# EAGLE design arduino-shield (EAGLE 9.2.2)

## Sheet 1 of 2
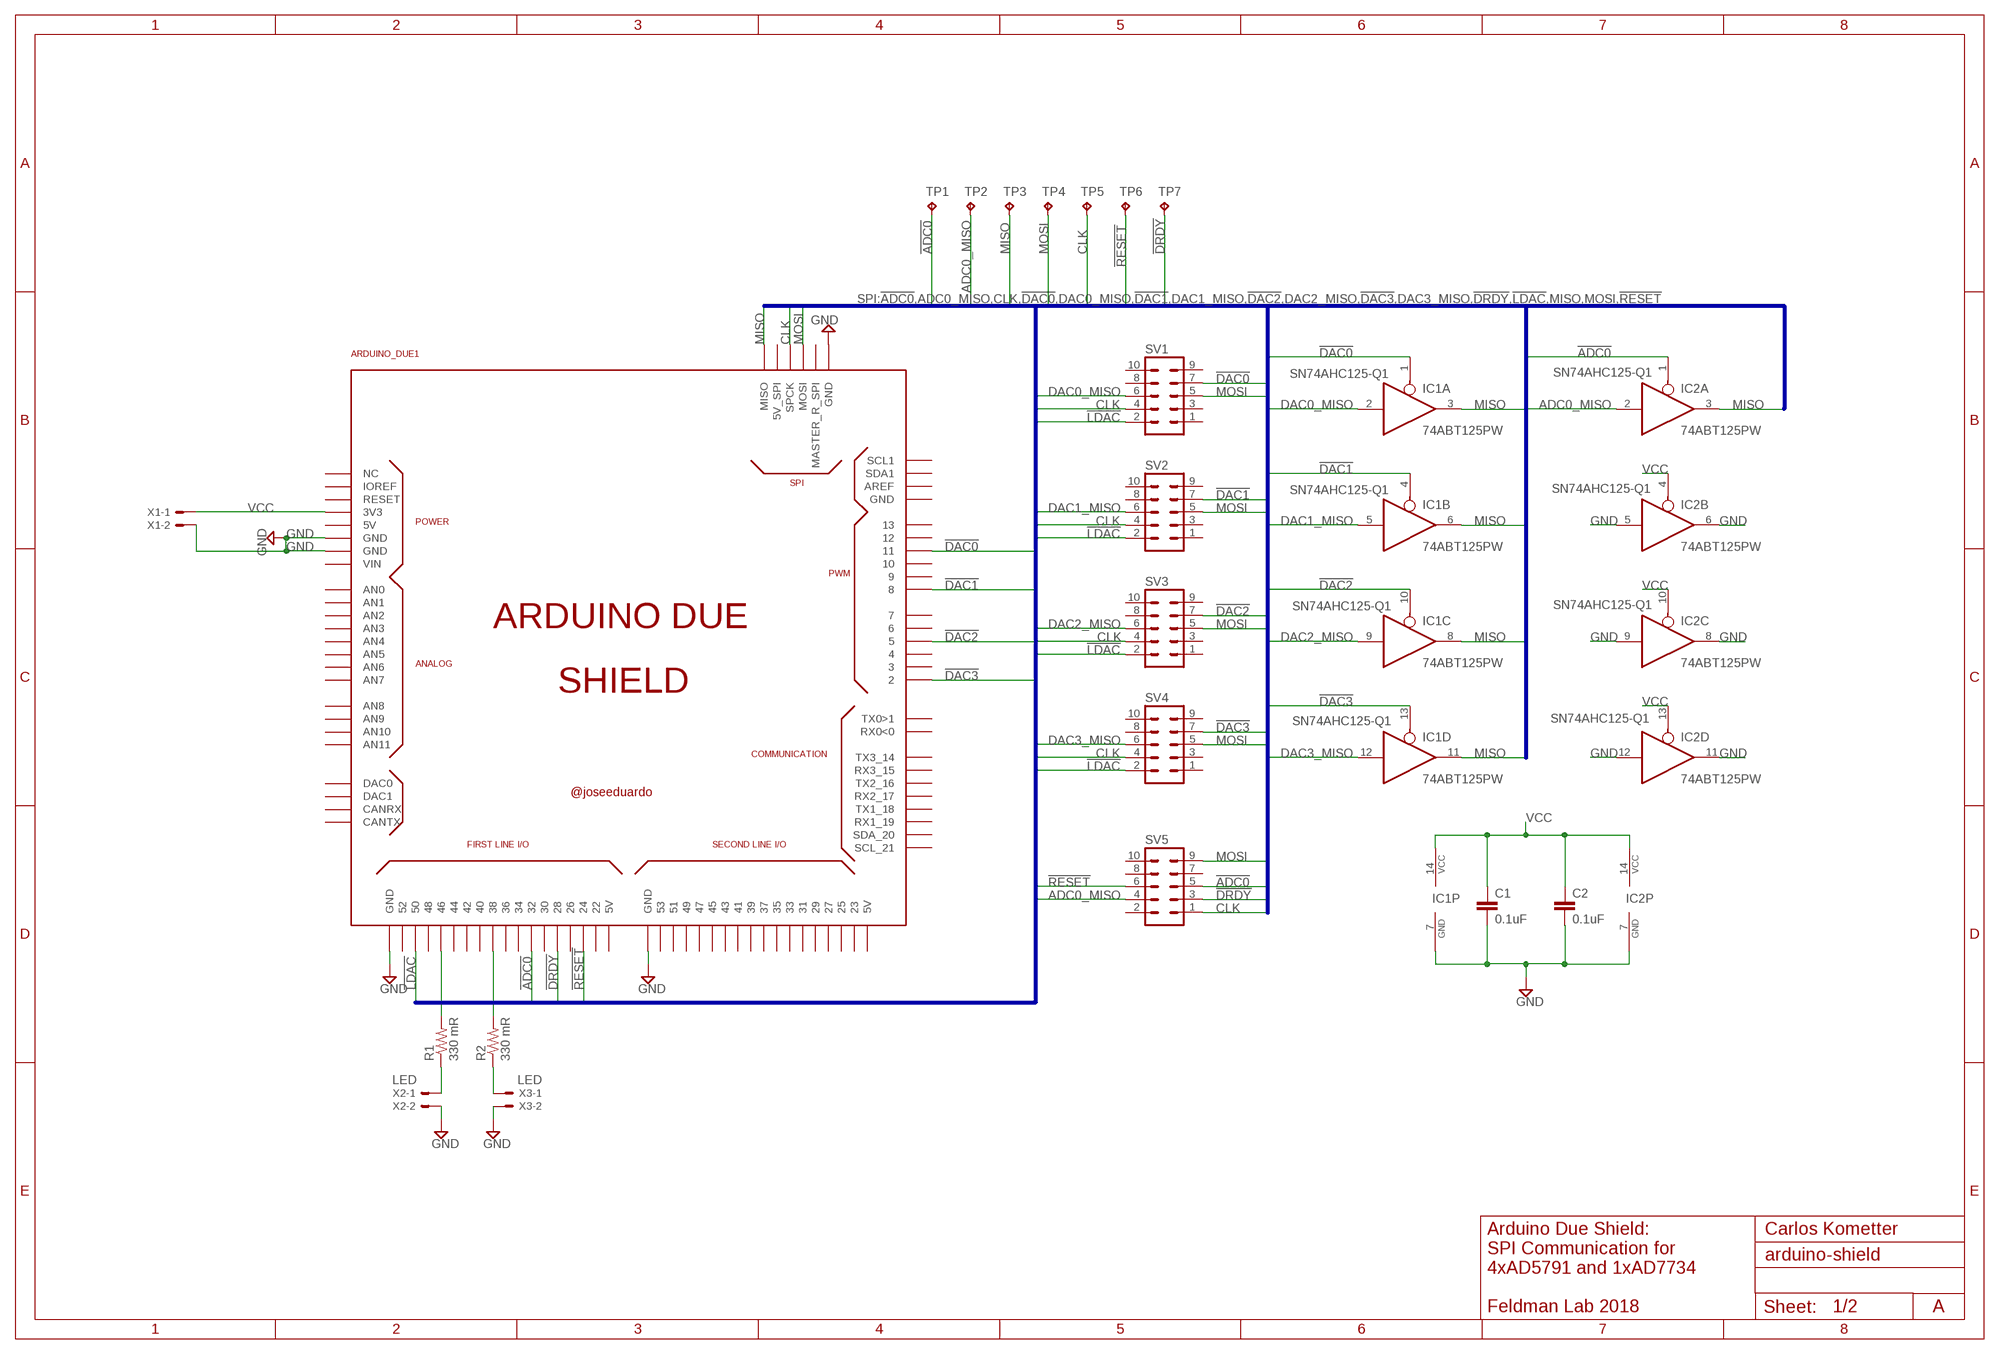
[diagram p0: schematic, sheet 1]

### Parts
ARDUINO_DUE1  ARDUINO_DUE_SHIELD  [ARDUINO_DUE_SHIELD]
C1  0.1uF  C-EUC0603  [C0603]
C2  0.1uF  C-EUC0603  [C0603]
IC1  74ABT125PW  [TSSOP14]
IC2  74ABT125PW  [TSSOP14]
R1  330 mR  R-US_R1206  [R1206]
R2  330 mR  R-US_R1206  [R1206]
SV1  MA05-2  [MA05-2]
SV2  MA05-2  [MA05-2]
SV3  MA05-2  [MA05-2]
SV4  MA05-2  [MA05-2]
SV5  MA05-2  [MA05-2]
TP1  TPPAD1-13  [P1-13]
TP2  TPPAD1-13  [P1-13]
TP3  TPPAD1-13  [P1-13]
TP4  TPPAD1-13  [P1-13]
TP5  TPPAD1-13  [P1-13]
TP6  TPPAD1-13  [P1-13]
TP7  TPPAD1-13  [P1-13]
X1  22-23-2021  [22-23-2021]
X2  22-23-2021  [22-23-2021]
X3  22-23-2021  [22-23-2021]

### Nets
!ADC0!: ARDUINO_DUE1.32 IC2.1(A:OE) SV5.5 TP1.TP
!DAC0!: ARDUINO_DUE1.11 IC1.1(A:OE) SV1.7
!DAC1!: ARDUINO_DUE1.8 IC1.4(B:OE) SV2.7
!DAC2!: ARDUINO_DUE1.5 IC1.10(C:OE) SV3.7
!DAC3!: ARDUINO_DUE1.2 IC1.13(D:OE) SV4.7
!DRDY!: ARDUINO_DUE1.28 SV5.3 TP7.TP
!LDAC!: ARDUINO_DUE1.50 SV1.2 SV2.2 SV3.2 SV4.2
!RESET!: ARDUINO_DUE1.24 SV5.6 TP6.TP
ADC0_MISO: IC2.2(A:I) SV5.4 TP2.TP
CLK: ARDUINO_DUE1.SPCK SV1.4 SV2.4 SV3.4 SV4.4 SV5.1 TP5.TP
DAC0_MISO: IC1.2(A:I) SV1.6
DAC1_MISO: IC1.5(B:I) SV2.6
DAC2_MISO: IC1.9(C:I) SV3.6
DAC3_MISO: IC1.12(D:I) SV4.6
GND: ARDUINO_DUE1.GND ARDUINO_DUE1.GND_1(GND) ARDUINO_DUE1.GND_2(GND) ARDUINO_DUE1.GND_3(GND) ARDUINO_DUE1.GND_5(GND) C1.2 C2.2 IC1.7(P:GND) IC2.5(B:I) IC2.6(B:O) IC2.7(P:GND) IC2.8(C:O) IC2.9(C:I) IC2.11(D:O) IC2.12(D:I) X1.2 X2.2 X3.2
MISO: ARDUINO_DUE1.MISO IC1.3(A:O) IC1.6(B:O) IC1.8(C:O) IC1.11(D:O) IC2.3(A:O) TP3.TP
MOSI: ARDUINO_DUE1.MOSI SV1.5 SV2.5 SV3.5 SV4.5 SV5.9 TP4.TP
N$3: ARDUINO_DUE1.46 R1.2
N$4: R1.1 X2.1
N$6: ARDUINO_DUE1.38 R2.2
N$7: R2.1 X3.1
VCC: ARDUINO_DUE1.3V3 C1.1 C2.1 IC1.14(P:VCC) IC2.4(B:OE) IC2.10(C:OE) IC2.13(D:OE) IC2.14(P:VCC) X1.1
Unconnected: ARDUINO_DUE1.0(RX0<0) ARDUINO_DUE1.1(TX0>1) ARDUINO_DUE1.3 ARDUINO_DUE1.4 ARDUINO_DUE1.5V0(5V) ARDUINO_DUE1.5V0_1(5V) ARDUINO_DUE1.5V0_2(5V) ARDUINO_DUE1.5V_2(5V_SPI) ARDUINO_DUE1.6 ARDUINO_DUE1.7 ARDUINO_DUE1.9 ARDUINO_DUE1.10 ARDUINO_DUE1.12 ARDUINO_DUE1.13 ARDUINO_DUE1.14(TX3_14) ARDUINO_DUE1.15(RX3_15) ARDUINO_DUE1.16(TX2_16) ARDUINO_DUE1.17(RX2_17) ARDUINO_DUE1.18(TX1_18) ARDUINO_DUE1.19(RX1_19) ARDUINO_DUE1.20(SDA_20) ARDUINO_DUE1.21(SCL_21) ARDUINO_DUE1.22 ARDUINO_DUE1.23 ARDUINO_DUE1.25 ARDUINO_DUE1.26 ARDUINO_DUE1.27 ARDUINO_DUE1.29 ARDUINO_DUE1.30 ARDUINO_DUE1.31 ARDUINO_DUE1.33 ARDUINO_DUE1.34 ARDUINO_DUE1.35 ARDUINO_DUE1.36 ARDUINO_DUE1.37 ARDUINO_DUE1.39 ARDUINO_DUE1.40 ARDUINO_DUE1.41 ARDUINO_DUE1.42 ARDUINO_DUE1.43 ARDUINO_DUE1.44 ARDUINO_DUE1.45 ARDUINO_DUE1.47 ARDUINO_DUE1.48 ARDUINO_DUE1.49 ARDUINO_DUE1.51 ARDUINO_DUE1.52 ARDUINO_DUE1.53 ARDUINO_DUE1.A0(AN0) ARDUINO_DUE1.A1(AN1) ARDUINO_DUE1.A2(AN2) ARDUINO_DUE1.A3(AN3) ARDUINO_DUE1.A4(AN4) ARDUINO_DUE1.A5(AN5) ARDUINO_DUE1.A6(AN6) ARDUINO_DUE1.A7(AN7) ARDUINO_DUE1.A8(AN8) ARDUINO_DUE1.A9(AN9) ARDUINO_DUE1.A10(AN10) ARDUINO_DUE1.A11(AN11) ARDUINO_DUE1.AREF ARDUINO_DUE1.CANRX ARDUINO_DUE1.CANTX ARDUINO_DUE1.DAC0 ARDUINO_DUE1.DAC1 ARDUINO_DUE1.GND_4(GND) ARDUINO_DUE1.IOREF ARDUINO_DUE1.MASTER_RESET_SPI(MASTER_R_SPI) ARDUINO_DUE1.NC_2(NC) ARDUINO_DUE1.RESET ARDUINO_DUE1.SCL1 ARDUINO_DUE1.SDA1 ARDUINO_DUE1.VIN SV1.1 SV1.3 SV1.8 SV1.9 SV1.10 SV2.1 SV2.3 SV2.8 SV2.9 SV2.10 SV3.1 SV3.3 SV3.8 SV3.9 SV3.10 SV4.1 SV4.3 SV4.8 SV4.9 SV4.10 SV5.2 SV5.7 SV5.8 SV5.10

### Buses
SPI:!ADC0!,ADC0_MISO,CLK,!DAC0!,DAC0_MISO,!DAC1!,DAC1_MISO,!DAC2!,DAC2_MISO,!DAC3!,DAC3_MISO,!DRDY!,!LDAC!,MISO,MOSI,!RESET!

### Notes on the sheet
- SN74AHC125-Q1 | SN74AHC125-Q1
- SN74AHC125-Q1 | SN74AHC125-Q1
- SN74AHC125-Q1 | SN74AHC125-Q1
- SN74AHC125-Q1 | SN74AHC125-Q1
- LED | LED
- Carlos Kometter
- Arduino Due Shield:
  SPI Communication for
  4xAD5791 and 1xAD7734
  
  Feldman Lab 2018
- A

## Sheet 2 of 2
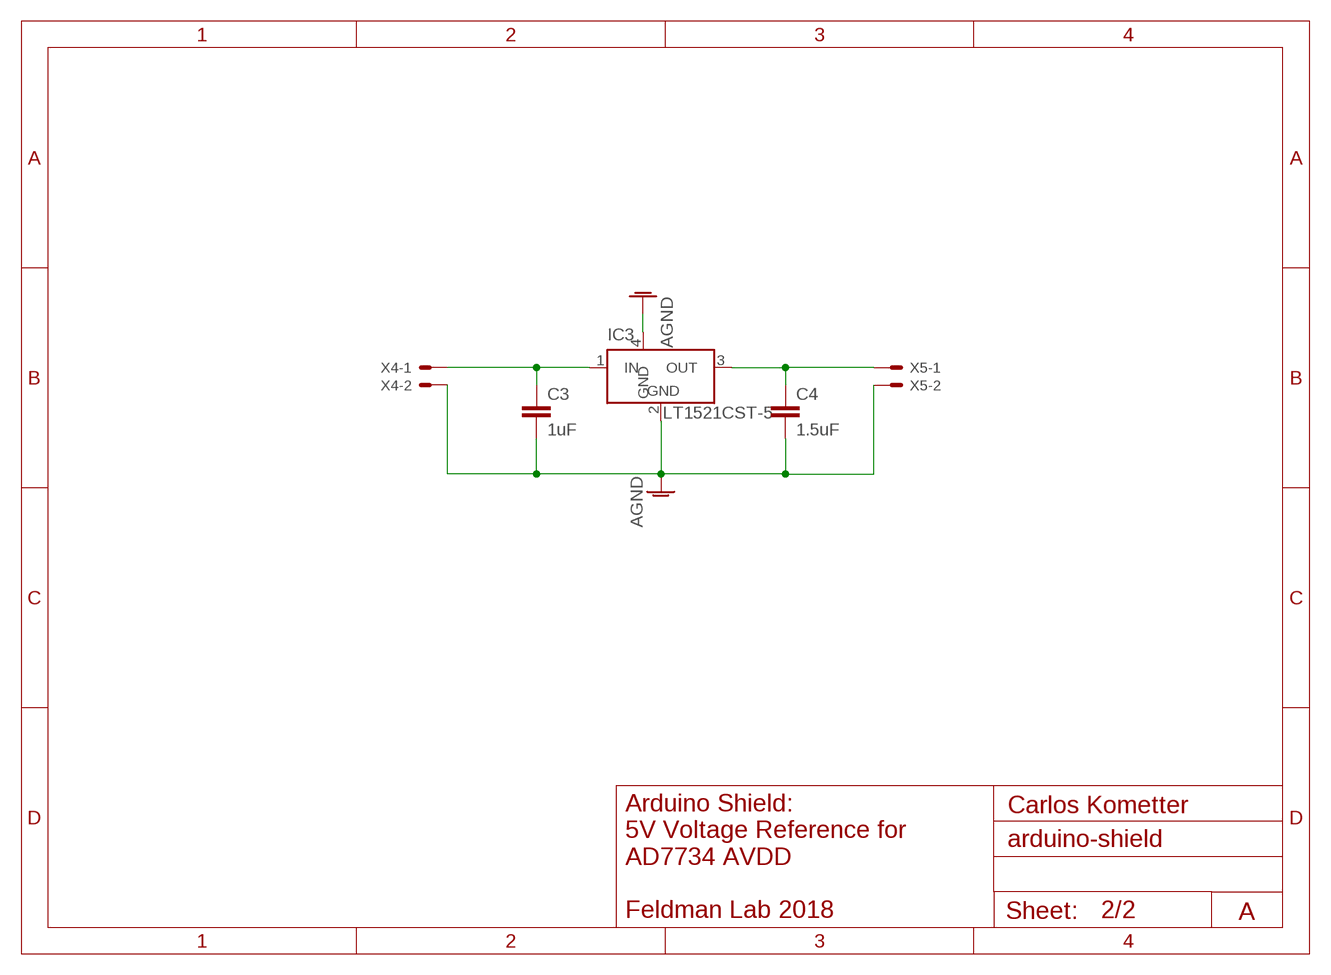
[diagram p1: schematic, sheet 2]

### Parts
C3  1uF  C-EUC0603  [C0603]
C4  1.5uF  C-EUC0603  [C0603]
IC3  LT1129CST5  [SOT223]
X4  22-23-2021  [22-23-2021]
X5  22-23-2021  [22-23-2021]

### Nets
AGND: C3.2 C4.2 IC3.2(GND) IC3.4(GND) X4.2 X5.2
N$1: C3.1 IC3.1(IN) X4.1
N$2: C4.1 IC3.3(OUT) X5.1

### Notes on the sheet
- LT1521CST-5
- Carlos Kometter
- Arduino Shield:
  5V Voltage Reference for
  AD7734 AVDD
  
  Feldman Lab 2018
- A

## Library data of the parts
ARDUINO_DUE1 = arduino_due_shield:ARDUINO_DUE_SHIELD
C1-C4 = resistor:C-EU: CAPACITOR, European symbol
IC1 IC2 = 74xx-us:74*125: Quad bus BUFFER, 3-state
IC3 = linear-technology:LT1129CST5: VOLTAGE REGULATOR with shutdown; MPN: LT1129CST-5#PBF; OC_FARNELL: 1663375; OC_NEWARK: 57M2069
R1 R2 = rcl:R-US_: RESISTOR, American symbol; SPICEPREFIX: R
SV1-SV5 = con-lstb:MA05-2: PIN HEADER; OC_FARNELL: unknown; OC_NEWARK: unknown
TP1-TP7 = testpad:TP: Test pad
X1-X5 = con-molex:22-23-2021: .100" (2.54mm) Center Header - 2 Pin; MF: MOLEX; MPN: 22-23-2021; OC_FARNELL: 1462926; OC_NEWARK: 25C3832

## Board
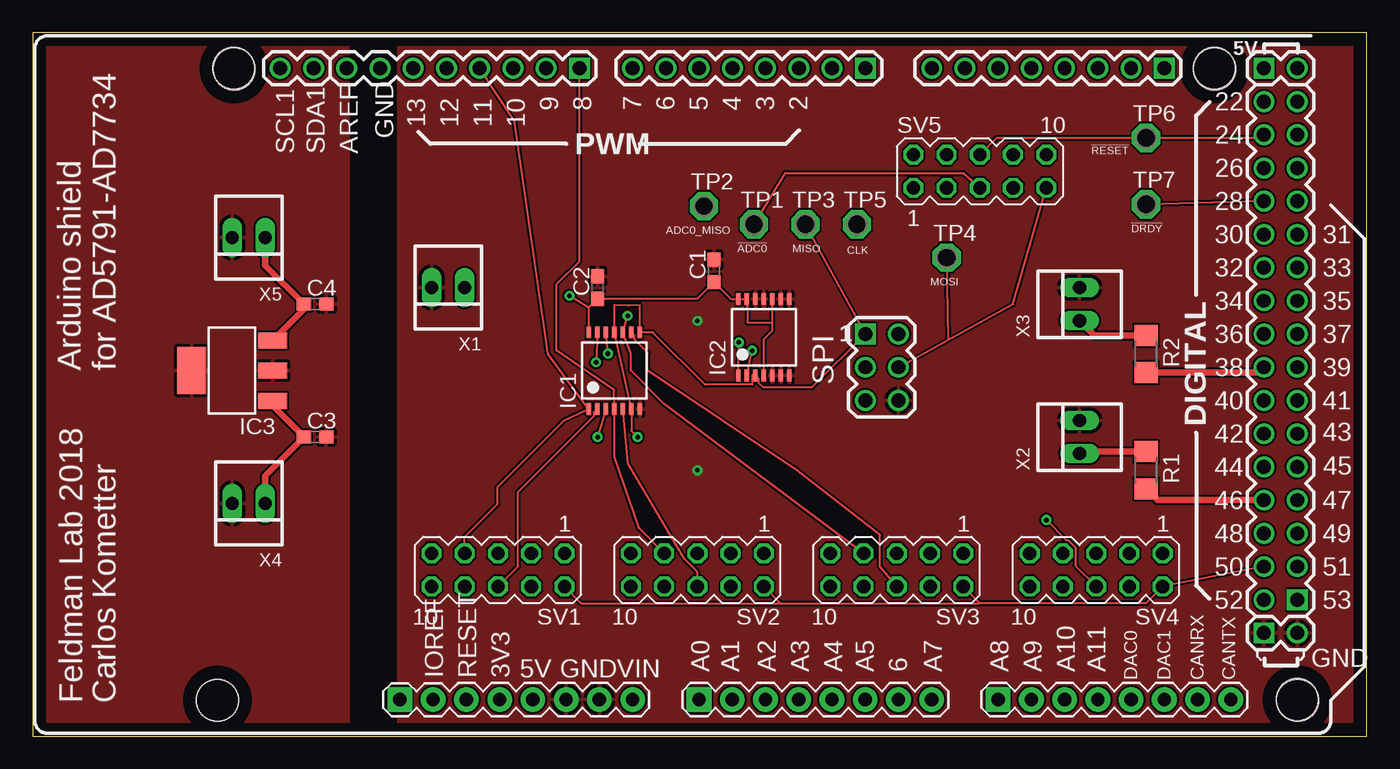
[diagram p2: board, top side]
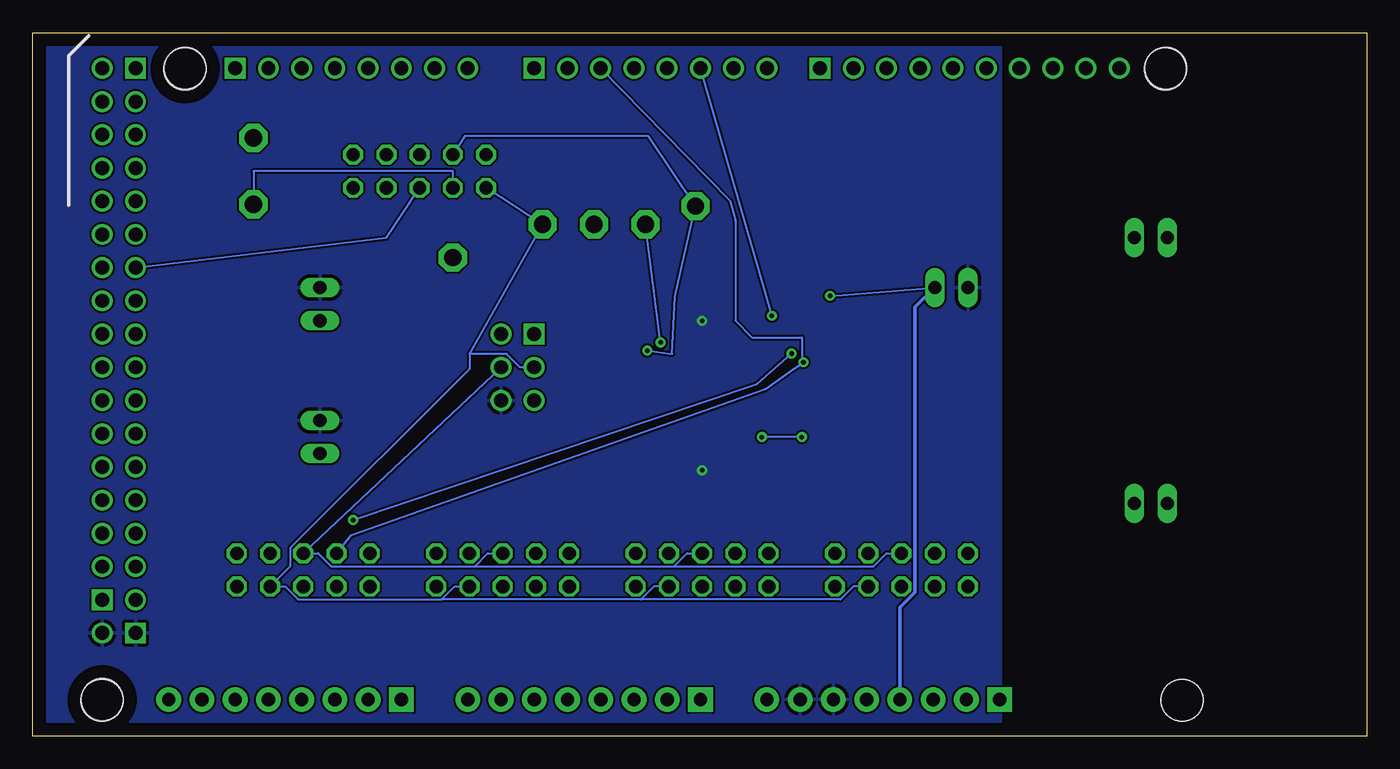
[diagram p3: board, bottom side, seen from below]

Size 101.96 x 53.77 mm. Coordinates in mm from the lower left corner, seen from the top.
Outline: 0,0 101.96,0 101.96,53.77 0,53.77 0,0
Copper layers (1*16): Top 0.035mm / dielectric 1.5mm / Bottom 0.035mm
Design rules "default": minimum track width 6mil, minimum drill 0.35mm, track to track 6mil, track to pad 6mil, pad to pad 6mil, via to via 6mil, smd to smd 6mil, copper to edge 40mil, drill to drill 6mil, minimum pad ring 10mil, minimum via ring 8mil, stop-mask expansion 4mil, vias tented up to drill 0mil, thermal gap 10mil

### Footprints (pad centres in the part's own frame; a part is rotated, then mirrored left to right if it is on the bottom)
ARDUINO_DUE_SHIELD = drill 1.067 square: 0 63.373,51.816; 5V0_1 93.853,51.816; 8 41.529,51.816; 21 86.233,51.816; 53 96.393,11.176; GND_2 93.853,8.636; MISO 63.373,31.496 | drill 1.067: 1 60.833,51.816; 2 58.293,51.816; 3 55.753,51.816; 4 53.213,51.816; 5 50.673,51.816; 5V0_2 96.393,51.816; 5V_2 65.913,31.496; 6 48.133,51.816; 7 45.593,51.816; 9 38.989,51.816; 10 36.449,51.816; 11 33.909,51.816; 12 31.369,51.816; 13 28.829,51.816; 14 68.453,51.816; 15 70.993,51.816; 16 73.533,51.816; 17 76.073,51.816; 18 78.613,51.816; 19 81.153,51.816; 20 83.693,51.816; 22 93.853,49.276; 23 96.393,49.276; 24 93.853,46.736; 25 96.393,46.736; 26 93.853,44.196; 27 96.393,44.196; 28 93.853,41.656; 29 96.393,41.656; 30 93.853,39.116; 31 96.393,39.116; 32 93.853,36.576; 33 96.393,36.576; 34 93.853,34.036; 35 96.393,34.036; 36 93.853,31.496; 37 96.393,31.496; 38 93.853,28.956; 39 96.393,28.956; 40 93.853,26.416; 41 96.393,26.416; 42 93.853,23.876; 43 96.393,23.876; 44 93.853,21.336; 45 96.393,21.336; 46 93.853,18.796; 47 96.393,18.796; 48 93.853,16.256; 49 96.393,16.256; 50 93.853,13.716; 51 96.393,13.716; 52 93.853,11.176; AREF 23.749,51.816; GND_3 96.393,8.636; GND_4 26.289,51.816; GND_5 65.913,26.416; MASTER_RESET_SPI 63.373,26.416; MOSI 65.913,28.956; SCL1 18.669,51.816; SDA1 21.209,51.816; SPCK 63.373,28.956 | drill 1.016 pad 1.88: 3V3 35.433,3.556; 5V0 37.973,3.556; A1 53.213,3.556; A2 55.753,3.556; A3 58.293,3.556; A4 60.833,3.556; A5 63.373,3.556; A6 65.913,3.556; A7 68.453,3.556; A9 76.073,3.556; A10 78.613,3.556; A11 81.153,3.556; CANRX 88.773,3.556; CANTX 91.313,3.556; DAC0 83.693,3.556; DAC1 86.233,3.556; GND 40.513,3.556; GND_1 43.053,3.556; IOREF 30.346,3.543; RESET 32.893,3.555; VIN 45.593,3.556 | drill 1.016 pad 1.88 square: A0 50.673,3.556; A8 73.533,3.556; NC_2 27.806,3.543 | hole 3.2: 15.113,51.816; 90.043,51.816; 96.393,3.556; 96.418,3.505; 15.138,51.765; 90.068,51.765; 13.868,3.505
C0603 = smd 1.1 x 1: 1 -0.85,0; 2 0.85,0
TSSOP14 = smd 0.35 x 0.9: 1 -1.95,-2.925; 2 -1.3,-2.925; 3 -0.65,-2.925; 4 0,-2.925; 5 0.65,-2.925; 6 1.3,-2.925; 7 1.95,-2.925; 8 1.95,2.925; 9 1.3,2.925; 10 0.65,2.925; 11 0,2.925; 12 -0.65,2.925; 13 -1.3,2.925; 14 -1.95,2.925
SOT223 = smd 1.219 x 2.235: 1 -2.311,-3.099; 2 0,-3.099; 3 2.311,-3.099 | smd 3.6 x 2.2: 4 0,3.099
R1206 = smd 1.6 x 1.803: 1 -1.422,0; 2 1.422,0
MA05-2 = drill 1.016 octagon: 1 -5.08,-1.27; 2 -5.08,1.27; 3 -2.54,-1.27; 4 -2.54,1.27; 5 0,-1.27; 6 0,1.27; 7 2.54,-1.27; 8 2.54,1.27; 9 5.08,-1.27; 10 5.08,1.27
P1-13 = drill 1.321 pad 2.159 octagon: TP 0,0
22-23-2021 = drill 1 long: 1 -1.27,0; 2 1.27,0

### Placement (x,y rotation side)
ARDUINO_DUE1  0.25,-0.76 0 top
C1  52.07,35.56 90 top
C2  43.18,34.29 90 top
C3  21.59,22.86 0 top
C4  21.59,33.02 0 top
IC1  44.45,27.94 0 top
IC2  55.88,30.48 0 top
IC3  15.24,27.94 90 top
R1  85.09,20.32 270 top
R2  85.09,29.21 270 top
SV1  35.56,12.7 180 top
SV2  50.8,12.7 180 top
SV3  66.04,12.7 180 top
SV4  81.28,12.7 180 top
SV5  72.39,43.18 0 top
TP1  55.12,39.12 0 top
TP2  51.31,40.51 0 top
TP3  59.05,39.12 0 top
TP4  69.85,36.58 0 top
TP5  62.99,39.12 0 top
TP6  85.09,45.72 0 top
TP7  85.09,40.64 0 top
X1  31.75,34.29 180 top
X2  80.01,22.86 90 top
X3  80.01,33.02 90 top
X4  16.51,17.78 180 top
X5  16.51,38.1 180 top

### Tracks (layer width: path | path; a pad name or v marks a point on that pad's centre or on a via)
!ADC0!  (via drill 0.35)
  Top 0.152: IC2.1 v53.98,30.1 | TP1.TP 57.53,43.05 71.12,43.05 SV5.5
  Bottom 0.152: v53.98,30.1 TP1.TP | ARDUINO_DUE1.32 74.93,38.1 SV5.5
!DAC0!
  Top 0.152: SV1.7 33.02,15.24 35.53,17.75 35.53,19.06 40.59,24.11 IC1.1 39.37,29.21 36.83,46.99 ARDUINO_DUE1.11
!DAC1!
  Top 0.152: SV2.7 46.32,15.91 44.45,21.33 IC1.4 44.44,26.45 40.03,29.46 40.03,34.54 41.78,36.29 ARDUINO_DUE1.8
!DAC2!  (via drill 0.35)
  Top 0.152: SV3.7 48.26,25.4 45.72,27.94 45.72,29.21 IC1.10 v45.47,32.13
  Bottom 0.152: v45.47,32.13 ARDUINO_DUE1.5
!DAC3!  (via drill 0.35)
  Top 0.152: IC1.13 v43.05,28.57
  Bottom 0.152: SV4.7 77.6,15.37 45.97,26.54 43.81,28.07 v43.05,28.57 43.18,28.7 43.18,30.48 46.99,30.48 48.26,31.75 48.26,39.44 48.66,40.92 ARDUINO_DUE1.2
!DRDY!
  Top 0.152: ARDUINO_DUE1.28 TP7.TP
  Bottom 0.152: SV5.3 69.85,43.18 85.09,43.18 TP7.TP
!LDAC!
  Top 0.152: ARDUINO_DUE1.50 SV4.2 85.09,10.16 72.39,10.16 | 72.39,10.16 SV3.2 | SV2.2 57.15,10.16 | 57.15,10.16 72.39,10.16 | SV1.2 41.91,10.16 57.15,10.16
!RESET!
  Top 0.152: ARDUINO_DUE1.24 arc-90 93.85,45.72 TP6.TP 73.66,45.72 SV5.6
ADC0_MISO  (via drill 0.35)
  Top 0.152: IC2.2 v54.99,29.46
  Bottom 0.152: v54.99,29.46 53.09,29.21 52.89,33.59 TP2.TP 54.9,45.85 68.96,45.85 SV5.4
AGND
  pour Top: 0,0 0,53.34 24.13,53.34 24.13,0
CLK
  Bottom 0.152: ARDUINO_DUE1.SPCK 64.71,28.19 65.74,29.22 66.59,29.22 66.61,29.21 68.58,29.21 | 68.58,29.21 68.58,28.07 82.27,14.38 82.27,12.98 SV4.4 82.68,11.43 81.69,10.44 70.71,10.44 | SV3.4 69.72,11.43 70.71,10.44 | SV2.4 54.48,11.43 55.47,10.44 | 55.47,10.44 70.71,10.44 | SV1.4 39.24,11.43 40.23,10.44 55.47,10.44 | 68.58,29.21 TP5.TP SV5.1
DAC0_MISO
  Top 0.152: SV1.6 37.11,12.98 37.11,18.68 42.9,24.47 42.9,24.77 IC1.2
DAC1_MISO
  Top 0.152: IC1.5 45.48,20.85 49.81,13.56 50.8,12.57 SV2.6
DAC2_MISO
  Top 0.152: SV3.6 64.75,12.98 64.75,13.74 64.77,15.37 58.42,20.32 46.99,27.94 46.99,29.33 46,30.32 46,30.62 IC1.9
DAC3_MISO  (via drill 0.35)
  Top 0.152: SV4.6 79.73,12.98 79.73,14.38 79.15,14.96 79.02,14.96 v77.47,16.51 | v43.96,29.24 IC1.12
  Bottom 0.152: v77.47,16.51 46.61,26.92 v43.96,29.24
GND  (via drill 0.35)
  other vias: 50.8,20.32 50.8,31.75
  pour Top: 27.94,53.34 101.6,53.34 101.6,0 27.94,0
  pour Bottom: 101.6,0 27.94,0 27.94,53.34 101.6,53.34
MISO  (via drill 0.35)
  Top 0.152: IC1.3 v43.18,22.86 | v46.23,22.86 45.75,23.34 IC1.6 IC1.11 44.44,31.87 44.44,32.93 45.55,32.9 46.41,32.93 46.41,32.51 IC1.8 47.38,30.86 51.37,26.88 54.98,26.88 54.98,27.55 IC2.3 55.48,27.31 55.48,27.01 55.82,26.67 59.56,26.67 ARDUINO_DUE1.MISO TP3.TP
  Bottom 0.152: v43.18,22.86 v46.23,22.86
MOSI
  Top 0.152: ARDUINO_DUE1.MOSI 69.96,30.28 | 69.96,30.28 74.93,33.02 SV5.9 | TP4.TP 69.96,30.28
  Bottom 0.152: ARDUINO_DUE1.MOSI SV4.5 80.14,13.97 79.15,12.98 68.17,12.98 | SV3.5 67.18,13.97 68.17,12.98 | SV2.5 51.94,13.97 52.93,12.98 | 68.17,12.98 52.93,12.98 | SV1.5 36.7,13.97 37.69,12.98 52.93,12.98
N$1
  Top 0.508: X4.1 17.78,19.9 C3.1 18.34,25.26 IC3.1
N$2
  Top 0.508: IC3.3 20.74,32.65 C4.1 17.78,35.98 X5.1
N$3
  Top 0.508: ARDUINO_DUE1.46 85.95,18.03 R1.2
N$4
  Top 0.508: R1.1 80.16,21.74 X2.1
N$6
  Top 0.508: ARDUINO_DUE1.38 93.7,27.79 R2.2
N$7
  Top 0.508: R2.1 81.13,30.63 X3.1
VCC  (via drill 0.35)
  Top 0.152: 42.5,32.76 C2.1 50.8,33.44 C1.1 53.38,33.41 IC2.14 IC2.13 54.61,31.62 56.53,31.62 | 42.5,32.76 IC1.14 | 42.5,32.76 v41.02,33.66 | IC2.4 55.88,30.35 56.53,31 56.53,31.62 | 56.53,31.62 IC2.10
  Bottom 0.152: v41.02,33.66 X1.1
  Bottom 0.254: ARDUINO_DUE1.3V3 35.69,9.83 34.52,11 34.52,32.79 X1.1

### Text on the board
tNames: !RESET! | ADC0_MISO | !DRDY! | !ADC0! | MISO | CLK | MOSI | Arduino shield / for AD5791-AD7734 | Feldman Lab 2018 | Carlos Kometter